# Altium schematic sheet Connections.SchDoc
size A; SheetNumber: 4; SheetTotal: 4
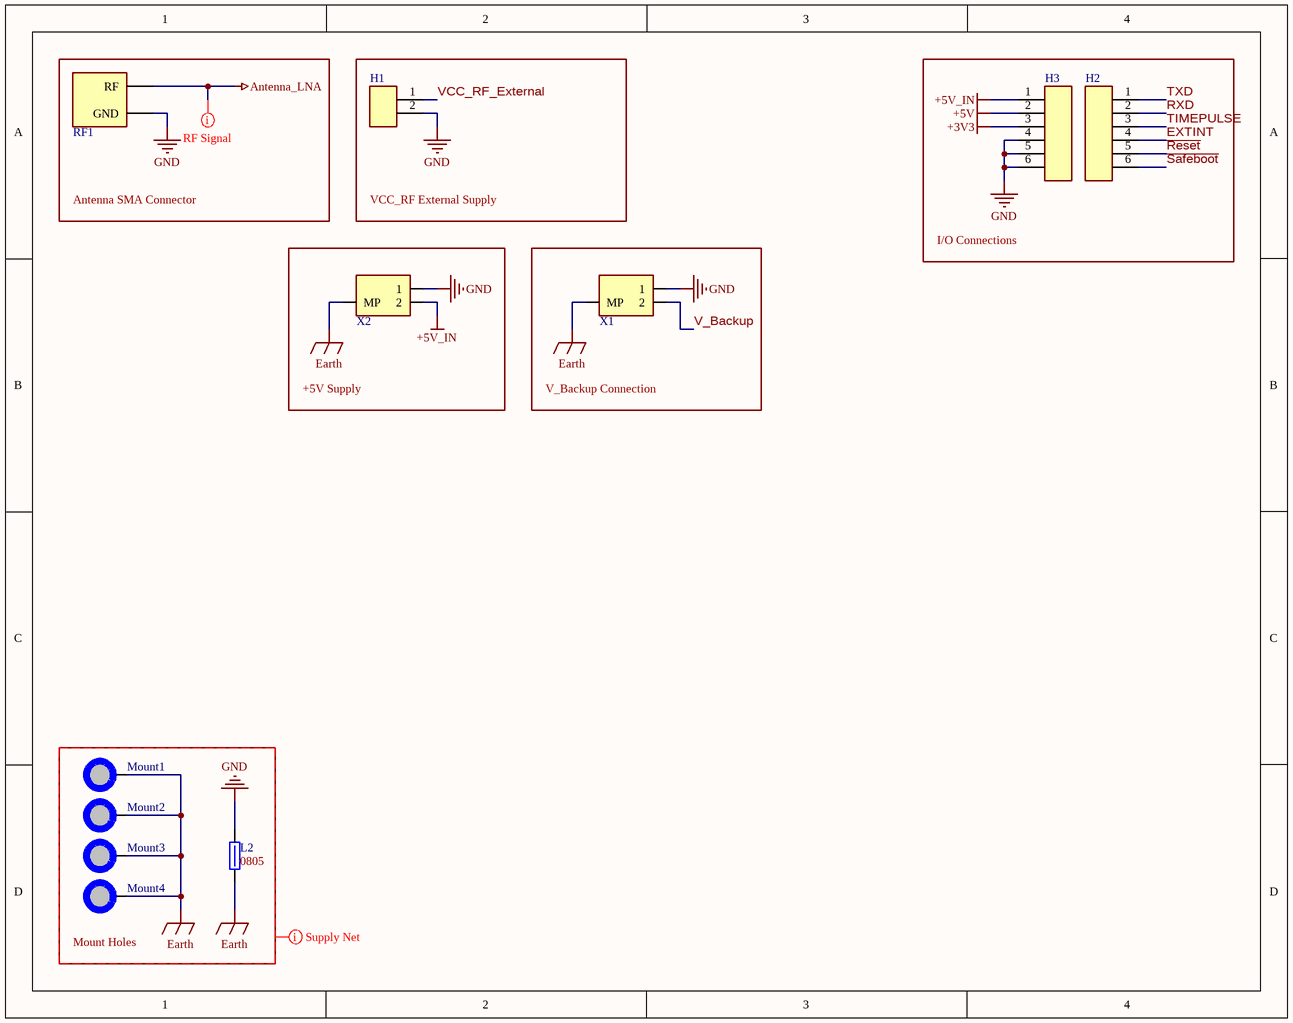
[diagram p0: Connections.SchDoc]

## Parts
H1  1x2 Header  [[Header] 1x2 Male]  (value not drawn)
H2  1x6 Header  [[Header] 1x6 Male]  (value not drawn)
H3  1x6 Header  [[Header] 1x6 Male]  (value not drawn)
L2  Size Package: 0805  [[Ferrite] SMD 0805]  (hidden comment: 652-MH2029-300Y)
Mount1  M3 Mount Hole  [[Mount] M3 Mount Hole]  (value not drawn)  (no BOM)
Mount2  M3 Mount Hole  [[Mount] M3 Mount Hole]  (value not drawn)  (no BOM)
Mount3  M3 Mount Hole  [[Mount] M3 Mount Hole]  (value not drawn)  (no BOM)
Mount4  M3 Mount Hole  [[Mount] M3 Mount Hole]  (value not drawn)  (no BOM)
RF1  [SMA] 90deg Thru-Hole  [[SMA] 90deg Thru-Hole]  (value not drawn)
X1  [Pheonix] 2pin 2.5mm pitch  [[Pheonix] 2pin 2.5mm pitch]  (value not drawn)
X2  [Pheonix] 2pin 2.5mm pitch  [[Pheonix] 2pin 2.5mm pitch]  (value not drawn)

## Blocks framed on the sheet
Antenna SMA Connector: RF1
VCC_RF External Supply: H1
I/O Connections: H2 H3
+5V Supply: X2
V_Backup Connection: X1
Mount Holes: L2 Mount1-Mount4

## Nets
+3V3: H3.3
+5V: H3.2
+5V_IN: H3.1 X2.2
Antenna_LNA: RF1.1(RF)
Earth: L2.1 Mount1.1 Mount2.1 Mount3.1 Mount4.1 X1.MP X2.MP
GND: H1.2 H3.4 H3.5 H3.6 L2.2 RF1.2(GND) X1.1 X2.1
~{Reset}: H2.5
~{Safeboot}: H2.6
EXTINT: H2.4
RXD: H2.2
TIMEPULSE: H2.3
TXD: H2.1
V_Backup: X1.2
VCC_RF_External: H1.1

## Layout directives
net class Supply_Nets: Earth, GND
net class nRF Signal: Antenna_LNA

## Library data of the parts
H1 = [Header] 1x2 Male: 2.54mm pitch
H2 H3 = [Header] 1x6 Male: 2.54mm pitch
L2 = [Ferrite] SMD 0805 3A 30ohm: Res @ Freq: 30 @ 100MHz; Supplier 1: DigiKey; Supplier Part Number 1: MH2029-300YCT-ND
Mount1-Mount4 = [Mount] M3 Mount Hole: Place at least 4.5mm from board edge. Plated.
RF1 = [SMA] 90deg Thru-Hole: RFPC-SMA27-F; Supplier 1: DigiKey; Supplier Part Number 1: 2073-RFPC-SMA27-F-ND
X1 X2 = [Pheonix] 2pin 2.5mm pitch: 1778764; Supplier 1: DigiKey; Supplier Part Number 1: 277-2315-1-ND